# Altium schematic sheet control_connector.SchDoc
size A4; SheetNumber: 7; SheetTotal: 11; SPICEModelCacheRONAVTZR: <root> / <DocumentId>RONAVTZR</DocumentId> / </root>
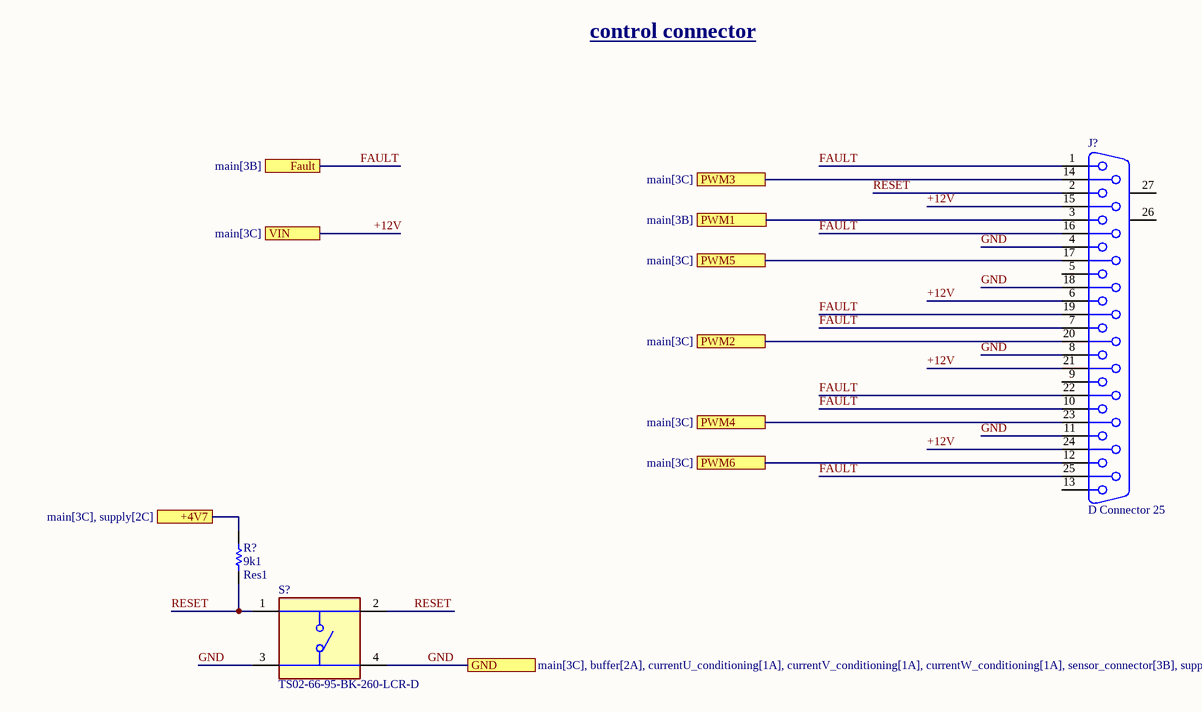
[diagram p0: control_connector.SchDoc]

## Parts
J?  D Connector 25  [DSUB1.385-2H25A]
R?  Res1  value 9k1  [AXIAL-0.3]
S?  TS02-66-95-BK-260-LCR-D  [SW_TS02-66-95-BK-260-LCR-D]

## Ports
+4V7 (see main[3C], supply[2C]), Fault (see main[3B]), GND (see main[3C], buffer[2A], currentU_conditioning[1A], currentV_conditioning[1A], currentW_conditioning[1A], sensor_connector[3B], supply[2A], uC_input[4B], uC_output[4B], voltage_conditioning[2A]), PWM1 (see main[3B]), PWM2 (see main[3C]), PWM3 (see main[3C]), PWM4 (see main[3C]), PWM5 (see main[3C]), PWM6 (see main[3C]), VIN (see main[3C])

## Nets
+4V7: R?.2 ; port +4V7
+12V: J?.6 J?.15 J?.21 J?.24 ; port VIN
FAULT: J?.1 J?.7 J?.10 J?.16 J?.19 J?.22 J?.25 ; port Fault
GND: J?.4 J?.8 J?.11 J?.18 S?.3 S?.4 ; port GND
PWM1: J?.3 ; port PWM1
PWM2: J?.20 ; port PWM2
PWM3: J?.14 ; port PWM3
PWM4: J?.23 ; port PWM4
PWM5: J?.17 ; port PWM5
PWM6: J?.12 ; port PWM6
RESET: J?.2 R?.1 S?.1 S?.2

Not connected (* = marked no-connect by the designer): J? 5 9 13 26(MH1) 27(MH2)

## Notes on the sheet
- control connector

## Library data of the parts
J? = D Connector 25: Receptacle Assembly, 25 Position, Right Angle; PackageDocument: U; Positions: 25; Published: 15-Jun-2001; LatestRevisionDate: 17-Jul-2002; LatestRevisionNote: Re-released for DXP Platform.; DatasheetDocument: 19-Mar-1999; PackageReference: 787202; Publisher: Altium Limited; Orientation: Right Angle; Gender: Receptacle
R? = Res1: Resistor; Published: 8-Jun-2000; LatestRevisionDate: 17-Jul-2002; LatestRevisionNote: Re-released for DXP Platform.; PackageReference: AXIAL-0.3; Publisher: Altium Limited; PackageDescription: Axial Device, Thru-Hole; 2 Leads; 0.3 in Pin Spacing
S? = TS02-66-95-BK-260-LCR-D: Price: None; Availability: Unavailable; MP: TS02-66-95-BK-260-LCR-D; Value: *; Package: None